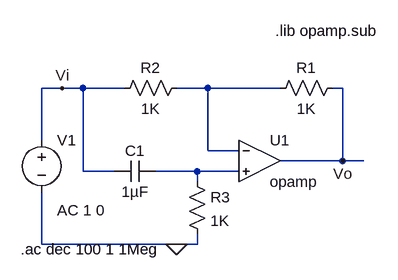
[diagram p0: schematic 7-1.asc]
7-1.asc, the LTspice schematic file:
Version 4
SHEET 1 880 680
WIRE -160 160 -192 160
WIRE -128 160 -160 160
WIRE -64 160 -128 160
WIRE 64 160 16 160
WIRE 176 160 64 160
WIRE 272 160 256 160
WIRE -192 240 -192 160
WIRE 64 256 64 160
WIRE 112 256 64 256
WIRE 272 272 272 160
WIRE 272 272 176 272
WIRE 304 272 272 272
WIRE -128 288 -128 160
WIRE -80 288 -128 288
WIRE 48 288 -16 288
WIRE 112 288 48 288
WIRE 48 304 48 288
WIRE -192 400 -192 320
WIRE 16 400 -192 400
WIRE 48 400 48 384
WIRE 48 400 16 400
FLAG 272 272 Vo
FLAG -160 160 Vi
FLAG 16 400 0
SYMBOL OpAmps\\opamp 144 208 R0
SYMATTR InstName U1
SYMBOL res 272 144 R90
WINDOW 0 0 56 VBottom 2
WINDOW 3 32 56 VTop 2
SYMATTR InstName R1
SYMATTR Value 1K
SYMBOL res 32 144 R90
WINDOW 0 0 56 VBottom 2
WINDOW 3 32 56 VTop 2
SYMATTR InstName R2
SYMATTR Value 1K
SYMBOL res 32 288 R0
SYMATTR InstName R3
SYMATTR Value 1K
SYMBOL cap -16 272 R90
WINDOW 0 0 32 VBottom 2
WINDOW 3 32 32 VTop 2
SYMATTR InstName C1
SYMATTR Value 1µF
SYMBOL voltage -192 224 R0
WINDOW 123 24 124 Left 2
WINDOW 39 0 0 Left 0
SYMATTR Value2 AC 1 0
SYMATTR InstName V1
SYMATTR Value ""
TEXT 168 72 Left 2 !.lib opamp.sub
TEXT -224 408 Left 2 !.ac dec 100 1 1Meg

The netlist it stands for:
* 7-1.asc
XU1 N001 N002 Vo opamp Aol=100K GBW=10Meg  ; pins invin noninvin out
R1 Vo N001 1K
R2 N001 Vi 1K
R3 N002 0 1K
C1 N002 Vi 1µF
V1 Vi 0 AC 1 0
.lib opamp.sub
.ac dec 100 1 1Meg
.backanno
.end